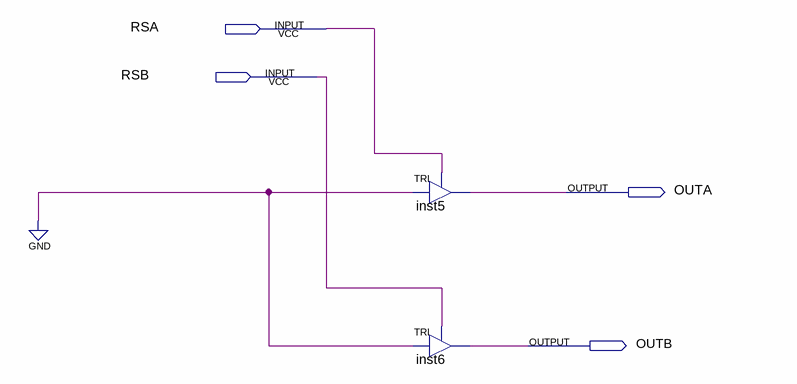
[diagram p0: schematic sheet]
// Quartus schematic RFC_0.bdf as structural Verilog: 2 symbols, 4 pins
module RFC_0 (
  input  RSA,
  input  RSB,
  output OUTA,
  output OUTB
);

  TRI inst5 (.IN(1'b0), .OE(RSA), .OUT(OUTA));
  TRI inst6 (.IN(1'b0), .OE(RSB), .OUT(OUTB));
endmodule
